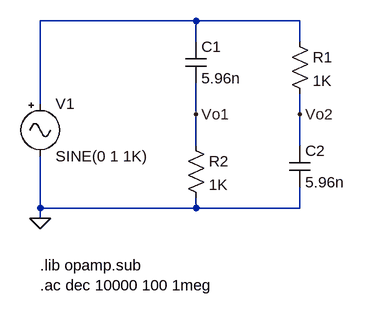
[diagram p0: schematic ej6.asc]
ej6.asc, the LTspice schematic file:
Version 4
SHEET 1 880 680
WIRE 304 176 64 176
WIRE 464 176 304 176
WIRE 304 208 304 176
WIRE 464 208 464 176
WIRE 64 304 64 176
WIRE 304 320 304 272
WIRE 464 320 464 288
WIRE 304 368 304 320
WIRE 464 368 464 320
WIRE 64 464 64 384
WIRE 304 464 304 448
WIRE 304 464 64 464
WIRE 464 464 464 432
WIRE 464 464 304 464
WIRE 64 480 64 464
FLAG 64 480 0
FLAG 304 320 Vo1
FLAG 464 320 Vo2
SYMBOL res 448 192 R0
SYMATTR InstName R1
SYMATTR Value 1K
SYMBOL res 288 352 R0
SYMATTR InstName R2
SYMATTR Value 1K
SYMBOL cap 288 208 R0
SYMATTR InstName C1
SYMATTR Value 5.96n
SYMBOL cap 448 368 R0
SYMATTR InstName C2
SYMATTR Value 5.96n
SYMBOL Misc/signal 64 288 R0
SYMATTR InstName V1
SYMATTR Value2 AC 1
TEXT 64 552 Left 2 !.lib opamp.sub\n.ac dec 10000 100 1meg

The netlist it stands for:
* ej6.asc
R1 N001 Vo2 1K
R2 Vo1 0 1K
C1 N001 Vo1 5.96n
C2 Vo2 0 5.96n
V1 N001 0 SINE(0 1 1K) AC 1
.lib opamp.sub
.ac dec 10000 100 1meg
.backanno
.end